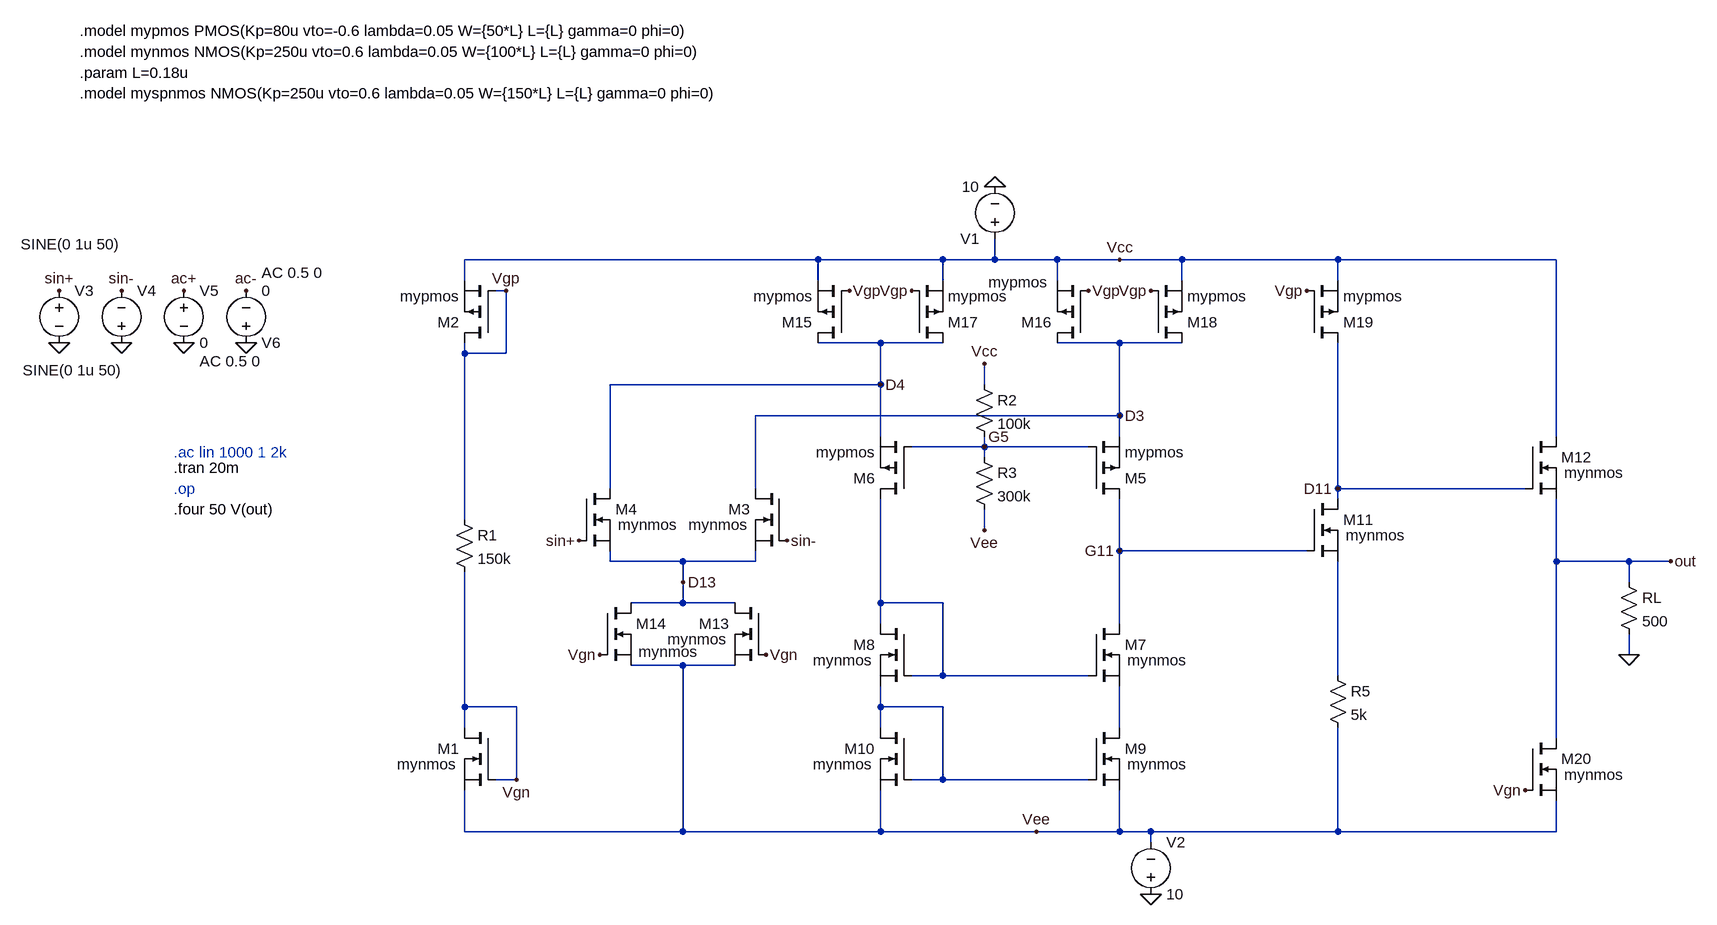
[diagram p0: schematic phase1_differential_amplifier.asc]
phase1_differential_amplifier.asc, the LTspice schematic file:
Version 4.1
SHEET 1 3256 900
WIRE -192 -176 -736 -176
WIRE 0 -176 -192 -176
WIRE 80 -176 80 -208
WIRE 80 -176 0 -176
WIRE 176 -176 80 -176
WIRE 272 -176 176 -176
WIRE 368 -176 272 -176
WIRE 608 -176 368 -176
WIRE 944 -176 608 -176
WIRE -736 -144 -736 -176
WIRE -192 -144 -192 -176
WIRE 0 -144 0 -176
WIRE 176 -144 176 -176
WIRE 368 -144 368 -176
WIRE 608 -144 608 -176
WIRE -672 -128 -688 -128
WIRE -96 -48 -192 -48
WIRE 0 -48 -96 -48
WIRE 272 -48 176 -48
WIRE 368 -48 272 -48
WIRE -736 -32 -736 -48
WIRE -672 -32 -672 -128
WIRE -672 -32 -736 -32
WIRE -96 16 -96 -48
WIRE -96 16 -512 16
WIRE 64 16 64 -16
WIRE 272 64 272 -48
WIRE 272 64 -288 64
WIRE -96 96 -96 16
WIRE 272 96 272 64
WIRE 944 96 944 -176
WIRE 64 112 64 96
WIRE 64 112 -48 112
WIRE 224 112 64 112
WIRE 64 128 64 112
WIRE -512 176 -512 16
WIRE -288 176 -288 64
WIRE 608 176 608 -48
WIRE 896 176 608 176
WIRE 608 192 608 176
WIRE -736 224 -736 -32
WIRE 64 240 64 208
WIRE 272 272 272 192
WIRE 560 272 272 272
WIRE -512 288 -512 272
WIRE -400 288 -512 288
WIRE -288 288 -288 272
WIRE -288 288 -400 288
WIRE 944 288 944 192
WIRE 1056 288 944 288
WIRE 1120 288 1056 288
WIRE -400 320 -400 288
WIRE 1056 320 1056 288
WIRE -400 352 -400 320
WIRE -400 352 -480 352
WIRE -320 352 -400 352
WIRE -96 352 -96 192
WIRE 0 352 -96 352
WIRE -96 384 -96 352
WIRE 272 384 272 272
WIRE 1056 432 1056 400
WIRE -400 448 -480 448
WIRE -320 448 -400 448
WIRE 0 464 0 352
WIRE 0 464 -48 464
WIRE 224 464 0 464
WIRE 608 464 608 288
WIRE -736 512 -736 304
WIRE -656 512 -736 512
WIRE -96 512 -96 480
WIRE 0 512 -96 512
WIRE -736 544 -736 512
WIRE -96 544 -96 512
WIRE 272 544 272 480
WIRE 944 560 944 288
WIRE -656 624 -656 512
WIRE -656 624 -688 624
WIRE 0 624 0 512
WIRE 0 624 -48 624
WIRE 224 624 0 624
WIRE -736 704 -736 640
WIRE -400 704 -400 448
WIRE -400 704 -736 704
WIRE -96 704 -96 640
WIRE -96 704 -400 704
WIRE 144 704 -96 704
WIRE 272 704 272 640
WIRE 272 704 144 704
WIRE 320 704 272 704
WIRE 608 704 608 544
WIRE 608 704 320 704
WIRE 944 704 944 656
WIRE 944 704 608 704
WIRE 320 720 320 704
FLAG 80 -288 0
FLAG 320 800 0
FLAG -672 -128 Vgp
FLAG 320 -128 Vgp
FLAG -656 624 Vgn
FLAG -272 432 Vgn
FLAG -528 432 Vgn
FLAG -144 -128 Vgp
FLAG -48 -128 Vgp
FLAG 224 -128 Vgp
FLAG 560 -128 Vgp
FLAG 896 640 Vgn
FLAG 1120 288 out
FLAG -1264 -48 0
FLAG -1360 -48 0
FLAG -1360 -128 sin+
FLAG -1264 -128 sin-
FLAG 272 -176 Vcc
FLAG 64 -16 Vcc
FLAG 144 704 Vee
FLAG 64 240 Vee
FLAG 1056 432 0
FLAG -96 16 D4
FLAG 272 64 D3
FLAG 272 272 G11
FLAG 608 176 D11
FLAG 64 112 G5
FLAG -400 320 D13
FLAG -1072 -48 0
FLAG -1168 -48 0
FLAG -1168 -128 ac+
FLAG -1072 -128 ac-
FLAG -560 256 sin+
FLAG -240 256 sin-
SYMBOL voltage 80 -192 R180
WINDOW 123 0 0 Left 0
WINDOW 39 0 0 Left 0
SYMATTR InstName V1
SYMATTR Value 10
SYMBOL voltage 320 816 M180
WINDOW 0 24 96 Left 2
WINDOW 3 24 16 Left 2
WINDOW 123 0 0 Left 0
WINDOW 39 0 0 Left 0
SYMATTR InstName V2
SYMATTR Value 10
SYMBOL nmos -688 544 M0
WINDOW 3 60 56 Left 2
SYMATTR Value mynmos
SYMATTR InstName M1
SYMBOL pmos -688 -48 R180
SYMATTR InstName M2
SYMATTR Value mypmos
SYMBOL res -752 208 R0
SYMATTR InstName R1
SYMATTR Value 150k
SYMBOL voltage -1360 -144 R0
WINDOW 3 -59 -56 Left 2
WINDOW 123 0 0 Left 0
WINDOW 39 0 0 Left 0
SYMATTR Value SINE(0 1u 50)
SYMATTR InstName V3
SYMBOL voltage -1264 -32 M180
WINDOW 0 24 96 Left 2
WINDOW 3 -152 -26 Left 2
WINDOW 123 0 0 Left 0
WINDOW 39 0 0 Left 0
SYMATTR InstName V4
SYMATTR Value SINE(0 1u 50)
SYMBOL res 48 0 R0
SYMATTR InstName R2
SYMATTR Value 100k
SYMBOL res 48 112 R0
SYMATTR InstName R3
SYMATTR Value 300k
SYMBOL res 1040 304 R0
SYMATTR InstName RL
SYMATTR Value 500
SYMBOL res 592 448 R0
SYMATTR InstName R5
SYMATTR Value 5k
SYMBOL nmos -240 176 M0
WINDOW 3 60 56 Left 2
SYMATTR Value mynmos
SYMATTR InstName M3
SYMBOL nmos -560 176 R0
WINDOW 3 60 56 Left 2
SYMATTR Value mynmos
SYMATTR InstName M4
SYMBOL pmos 224 192 M180
SYMATTR InstName M5
SYMATTR Value mypmos
SYMBOL pmos -48 192 R180
SYMATTR InstName M6
SYMATTR Value mypmos
SYMBOL nmos 224 384 R0
WINDOW 3 60 56 Left 2
SYMATTR Value mynmos
SYMATTR InstName M7
SYMBOL nmos -48 384 M0
WINDOW 3 60 56 Left 2
SYMATTR Value mynmos
SYMATTR InstName M8
SYMBOL nmos 224 544 R0
WINDOW 3 60 56 Left 2
SYMATTR Value mynmos
SYMATTR InstName M9
SYMBOL nmos -48 544 M0
WINDOW 3 60 56 Left 2
SYMATTR Value mynmos
SYMATTR InstName M10
SYMBOL nmos 560 192 R0
WINDOW 3 60 56 Left 2
SYMATTR Value mynmos
SYMATTR InstName M11
SYMBOL nmos 896 96 R0
WINDOW 3 60 56 Left 2
SYMATTR Value mynmos
SYMATTR InstName M12
SYMBOL nmos -272 352 M0
WINDOW 3 60 56 Left 2
SYMATTR Value mynmos
SYMATTR InstName M13
SYMBOL nmos -528 352 R0
WINDOW 3 60 75 Left 2
SYMATTR Value mynmos
SYMATTR InstName M14
SYMBOL pmos -144 -48 R180
SYMATTR InstName M15
SYMATTR Value mypmos
SYMBOL pmos 224 -48 R180
WINDOW 3 62 93 Left 2
SYMATTR Value mypmos
SYMATTR InstName M16
SYMBOL pmos -48 -48 M180
SYMATTR InstName M17
SYMATTR Value mypmos
SYMBOL pmos 320 -48 M180
SYMATTR InstName M18
SYMATTR Value mypmos
SYMBOL pmos 560 -48 M180
SYMATTR InstName M19
SYMATTR Value mypmos
SYMBOL nmos 896 560 R0
WINDOW 3 60 56 Left 2
SYMATTR Value mynmos
SYMATTR InstName M20
SYMBOL voltage -1168 -144 R0
WINDOW 123 24 124 Left 2
WINDOW 39 0 0 Left 0
SYMATTR Value2 AC 0.5 0
SYMATTR InstName V5
SYMATTR Value 0
SYMBOL voltage -1072 -32 M180
WINDOW 123 24 124 Left 2
WINDOW 39 0 0 Left 0
SYMATTR Value2 AC 0.5 0
SYMATTR InstName V6
SYMATTR Value 0
TEXT -1328 -464 Left 2 !.param L=0.18u
TEXT -1328 -496 Left 2 !.model mynmos NMOS(Kp=250u vto=0.6 lambda=0.05 W={100*L} L={L} gamma=0 phi=0)
TEXT -1328 -528 Left 2 !.model mypmos PMOS(Kp=80u vto=-0.6 lambda=0.05 W={50*L} L={L} gamma=0 phi=0)
TEXT -1328 -432 Left 2 !.model myspnmos NMOS(Kp=250u vto=0.6 lambda=0.05 W={150*L} L={L} gamma=0 phi=0)
TEXT -1184 176 Left 2 ;.op
TEXT -1184 144 Left 2 !.tran 20m
TEXT -1184 208 Left 2 !.four 50 V(out)
TEXT -1184 120 Left 2 ;.ac lin 1000 1 2k

The netlist it stands for:
* phase1_differential_amplifier.asc
V1 Vcc 0 10
V2 0 Vee 10
M1 Vgn Vgn Vee Vee mynmos
M2 Vgp Vgp Vcc Vcc mypmos
R1 Vgp Vgn 150k
V3 sin+ 0 SINE(0 1u 50)
V4 0 sin- SINE(0 1u 50)
R2 Vcc G5 100k
R3 G5 Vee 300k
RL out 0 500
R5 N002 Vee 5k
M3 D3 sin- D13 D13 mynmos
M4 D4 sin+ D13 D13 mynmos
M5 G11 G5 D3 D3 mypmos
M6 N001 G5 D4 D4 mypmos
M7 G11 N001 N004 N004 mynmos
M8 N001 N001 N003 N003 mynmos
M9 N004 N003 Vee Vee mynmos
M10 N003 N003 Vee Vee mynmos
M11 D11 G11 N002 N002 mynmos
M12 Vcc D11 out out mynmos
M13 D13 Vgn Vee Vee mynmos
M14 D13 Vgn Vee Vee mynmos
M15 D4 Vgp Vcc Vcc mypmos
M16 D3 Vgp Vcc Vcc mypmos
M17 D4 Vgp Vcc Vcc mypmos
M18 D3 Vgp Vcc Vcc mypmos
M19 D11 Vgp Vcc Vcc mypmos
M20 out Vgn Vee Vee mynmos
V5 ac+ 0 0 AC 0.5 0
V6 0 ac- 0 AC 0.5 0
.model NMOS NMOS
.model PMOS PMOS
.lib standard.mos
.param L=0.18u
.model mynmos NMOS(Kp=250u vto=0.6 lambda=0.05 W={100*L} L={L} gamma=0 phi=0)
.model mypmos PMOS(Kp=80u vto=-0.6 lambda=0.05 W={50*L} L={L} gamma=0 phi=0)
.model myspnmos NMOS(Kp=250u vto=0.6 lambda=0.05 W={150*L} L={L} gamma=0 phi=0)
* .op
.tran 20m
.four 50 V(out)
* .ac lin 1000 1 2k
.backanno
.end